# EAGLE schematic PE RM (EAGLE 7.6.0)
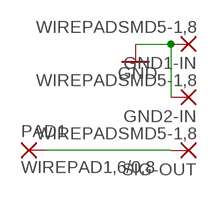
[diagram p0: schematic, sheet 1]

## Parts
GND1-IN  WIREPADSMD5-1,8  [5-1,8]
GND2-IN  WIREPADSMD5-1,8  [5-1,8]
PAD1  WIREPAD1,6/0,8  [1,6/0,8]
SIG-OUT  WIREPADSMD5-1,8  [5-1,8]

## Nets
GND: GND1-IN.1(P) GND2-IN.1(P)
SIG: PAD1.1(P) SIG-OUT.1(P)

## Library data of the parts
GND1-IN GND2-IN PAD1 SIG-OUT = wirepad:WIREPAD: Wire PAD connect wire on PCB